# EAGLE design shiftregisters (EAGLE 6.2)
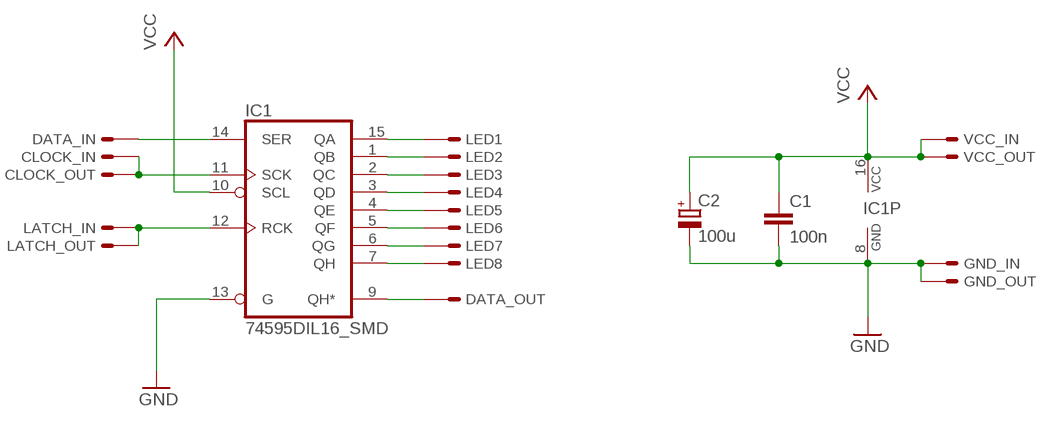
[diagram p0: schematic, sheet 1]

## Parts
C1  100n  C-EUC0805K  [C0805K]
C2  100u  CPOL-EUE2.5-5-L-12-SMD  [E2,5-5-L-12SMD]
CLOCK_IN  PINS-1-1SMD  [SMD]
CLOCK_OUT  PINS-1-1SMD  [SMD]
DATA_IN  PINS-1-1SMD  [SMD]
DATA_OUT  PINS-1-1SMD  [SMD]
GND_IN  PINS-1-1SMD  [SMD]
GND_OUT  PINS-1-1SMD  [SMD]
IC1  74595DIL16_SMD  [DIL16_SMD]
LATCH_IN  PINS-1-1SMD  [SMD]
LATCH_OUT  PINS-1-1SMD  [SMD]
LED1  PINS-1-1SMD  [SMD]
LED2  PINS-1-1SMD  [SMD]
LED3  PINS-1-1SMD  [SMD]
LED4  PINS-1-1SMD  [SMD]
LED5  PINS-1-1SMD  [SMD]
LED6  PINS-1-1SMD  [SMD]
LED7  PINS-1-1SMD  [SMD]
LED8  PINS-1-1SMD  [SMD]
VCC_IN  PINS-1-1SMD  [SMD]
VCC_OUT  PINS-1-1SMD  [SMD]

## Nets
GND: C1.2 C2.- GND_IN.1(S) GND_OUT.1(S) IC1.8(GND) IC1.13(G)
N$1: IC1.15(QA) LED1.1(S)
N$2: IC1.1(QB) LED2.1(S)
N$3: IC1.2(QC) LED3.1(S)
N$4: IC1.3(QD) LED4.1(S)
N$5: IC1.4(QE) LED5.1(S)
N$6: IC1.5(QF) LED6.1(S)
N$7: IC1.6(QG) LED7.1(S)
N$8: IC1.7(QH) LED8.1(S)
N$11: DATA_IN.1(S) IC1.14(SER)
N$12: DATA_OUT.1(S) IC1.9(QH*)
N$13: CLOCK_IN.1(S) CLOCK_OUT.1(S) IC1.11(SCK)
N$14: IC1.12(RCK) LATCH_IN.1(S) LATCH_OUT.1(S)
VCC: C1.1 C2.+ IC1.10(SCL) IC1.16(VCC) VCC_IN.1(S) VCC_OUT.1(S)

## Library data of the parts
C1 = rcl:C-EU: CAPACITOR, European symbol
C2 = elkos:CPOL-EU: POLARIZED CAPACITOR, European symbol
CLOCK_IN CLOCK_OUT DATA_IN DATA_OUT GND_IN GND_OUT LATCH_IN LATCH_OUT LED1-LED8 VCC_IN VCC_OUT = pads:PINS-1-1
IC1 = 74xx:74*595: 8-bit SHIFT REGISTER, output latch

## Board
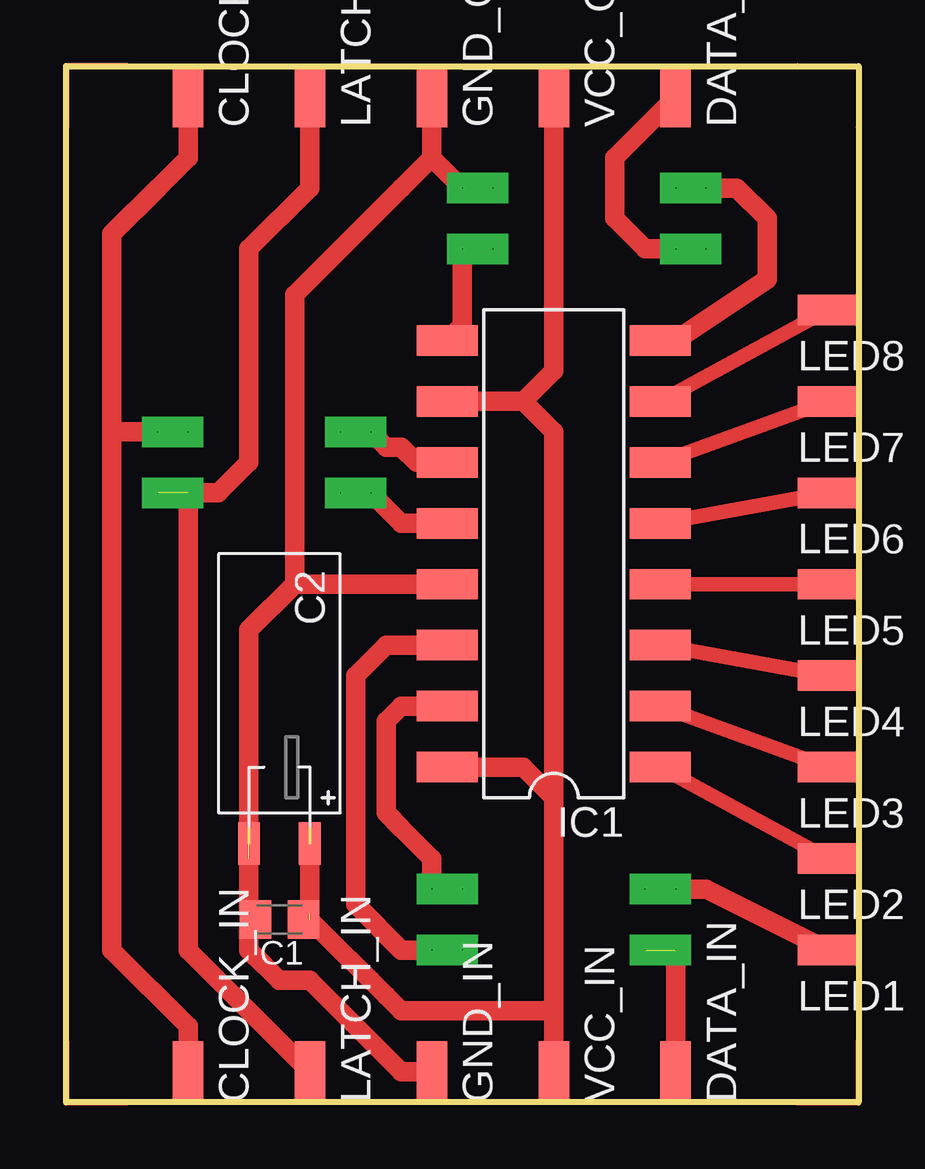
[diagram p1: board, top side]
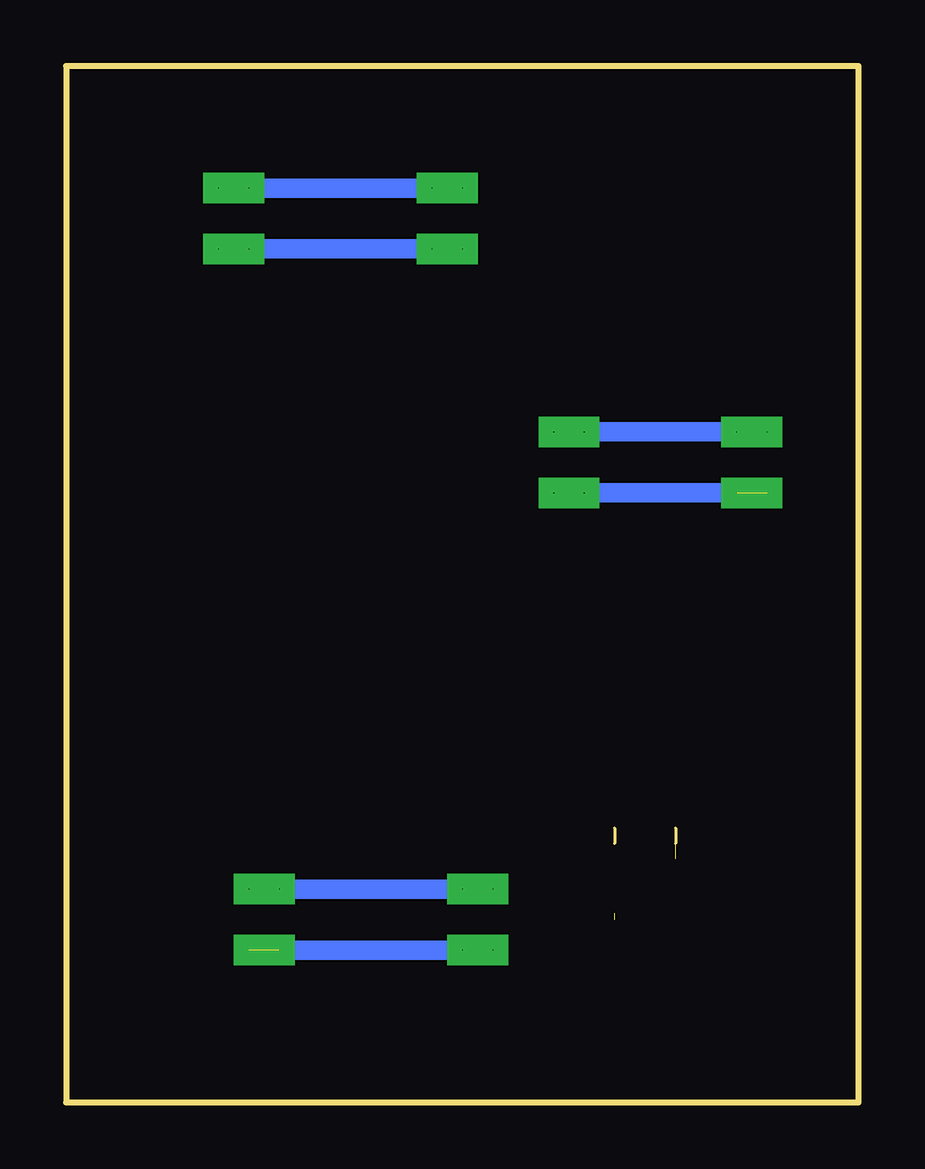
[diagram p2: board, bottom side, seen from below]

Size 33.02 x 43.18 mm. Coordinates in mm from the lower left corner, seen from the top.
Outline: 0,43.18 33.02,43.18 33.02,0 0,0 0,43.18
Copper layers (1*16): Top 0.035mm / dielectric 1.5mm / Bottom 0.035mm
Design rules "default *": minimum track width 10mil, minimum drill 24mil, track to track 8mil, track to pad 8mil, pad to pad 8mil, via to via 8mil, smd to smd 8mil, copper to edge 40mil, drill to drill 8mil, minimum pad ring 10mil, minimum via ring 8mil, stop-mask expansion 4mil, vias tented up to drill 0mil, thermal gap 10mil

### Footprints (pad centres in the part's own frame; a part is rotated, then mirrored left to right if it is on the bottom)
C0805K = smd 1.3 x 1.6: 1 -1,0; 2 1,0
E2,5-5-L-12SMD = smd 0.914 x 1.778: + -1.27,0.635; - 1.27,0.635
SMD = smd 2.54 x 1.27: 1 0,0
DIL16_SMD = smd 1.27 x 2.54: 1 -8.89,-4.445; 2 -6.35,-4.445; 3 -3.81,-4.445; 4 -1.27,-4.445; 5 1.27,-4.445; 6 3.81,-4.445; 7 6.35,-4.445; 8 8.89,-4.445; 9 8.89,4.445; 10 6.35,4.445; 11 3.81,4.445; 12 1.27,4.445; 13 -1.27,4.445; 14 -3.81,4.445; 15 -6.35,4.445; 16 -8.89,4.445

### Placement (x,y rotation side)
C1  8.89,7.62 180 top
C2  8.89,11.43 180 top
CLOCK_IN  5.08,1.27 90 top
CLOCK_OUT  5.08,41.91 90 top
DATA_IN  25.4,1.27 90 top
DATA_OUT  25.4,41.91 90 top
GND_IN  15.24,1.27 90 top
GND_OUT  15.24,41.91 90 top
IC1  20.32,22.86 90 top
LATCH_IN  10.16,1.27 90 top
LATCH_OUT  10.16,41.91 90 top
LED1  31.75,6.35 0 top
LED2  31.75,10.16 0 top
LED3  31.75,13.97 0 top
LED4  31.75,17.78 0 top
LED5  31.75,21.59 0 top
LED6  31.75,25.4 0 top
LED7  31.75,29.21 0 top
LED8  31.75,33.02 0 top
VCC_IN  20.32,1.27 90 top
VCC_OUT  20.32,41.91 90 top

### Tracks (layer width: path | path; a pad name or v marks a point on that pad's centre or on a via)
GND  (via drill 0.03 pad 1.27)  (1 unrouted)
  Top 0.813: IC1.13 12.7,21.59 9.53,21.59 | GND_OUT.1 15.24,40.64 | IC1.8 25.4,31.75 29.21,34.29 29.21,36.83 27.94,38.1 v26.67,38.1 v25.4,38.1 | v17.78,38.1 v16.51,38.1 15.24,39.37 | 15.24,39.37 15.24,40.64 | 15.24,40.64 15.24,39.37 | 15.24,39.37 13.97,38.1 9.53,33.66 9.53,32.39 9.53,21.59 | 9.53,21.59 7.62,19.68 C2.- | 7.62,10.16 7.62,7.89 C1.2 7.62,7.35 7.62,6.35 8.26,5.71 8.89,5.08 10.16,5.08 13.97,1.27 GND_IN.1
  Bottom 0.813: v17.78,38.1 v25.4,38.1
N$1  (via drill 0.03 pad 1.27)
  Top 0.813: v16.51,8.89 v15.24,8.89 15.24,10.16 13.97,11.43 13.33,12.07 13.33,15.88 13.97,16.51 15.24,16.51 IC1.15 | LED1.1 26.67,8.89 v25.4,8.89 v24.13,8.89
  Bottom 0.813: v16.51,8.89 v24.13,8.89
N$2
  Top 0.61: IC1.1 LED2.1
N$3
  Top 0.61: IC1.2 LED3.1
N$4
  Top 0.61: IC1.3 LED4.1
N$5
  Top 0.61: IC1.4 LED5.1
N$6
  Top 0.61: IC1.5 LED6.1
N$7
  Top 0.61: IC1.6 LED7.1
N$8
  Top 0.61: IC1.7 LED8.1
N$9
  Top 0.254: 0,2.54 0,0 2.54,0
N$10
  Top 0.254: 30.48,0 33.02,0 33.02,2.54
N$11  (via drill 0.03 pad 1.27)  (1 unrouted)
  Top 0.813: v16.51,6.35 v15.24,6.35 13.97,6.35 12.06,8.25 12.06,17.78 13.33,19.05 IC1.14 | DATA_IN.1 v25.4,6.35
  Bottom 0.813: v16.51,6.35 v24.13,6.35
N$12  (via drill 0.03 pad 1.27)
  Top 0.813: IC1.9 16.51,32.39 16.51,34.29 v16.51,35.56 v17.78,35.56 | v26.67,35.56 v25.4,35.56 24.13,35.56 22.86,36.83 22.86,39.37 DATA_OUT.1
  Bottom 0.813: v17.78,35.56 v25.4,35.56
N$13  (via drill 0.03 pad 1.27)
  Top 0.813: CLOCK_OUT.1 5.08,39.37 3.81,38.1 1.91,36.19 1.91,27.94 | v11.43,27.94 v12.7,27.94 13.33,27.31 13.97,27.31 14.6,26.67 IC1.11 | v5.08,27.94 v3.81,27.94 1.91,27.94 | CLOCK_IN.1 5.08,3.18 1.91,6.35 1.91,27.94
  Bottom 0.813: v5.08,27.94 v11.43,27.94
N$14  (via drill 0.03 pad 1.27)  (1 unrouted)
  Top 0.813: LATCH_OUT.1 10.16,39.37 10.16,38.1 7.62,35.56 7.62,26.67 6.35,25.4 v5.08,25.4 5.08,6.35 LATCH_IN.1 | v11.43,25.4 v12.7,25.4 13.97,24.13 IC1.12
  Bottom 0.813: v5.08,25.4 v11.43,25.4
  other vias: 3.81,25.4
N$15
  Top 0.254: 30.48,43.18 33.02,43.18 33.02,40.64
N$16
  Top 0.254: 2.54,43.18 0,43.18 0,40.64
VCC  (2 unrouted)
  Top 0.813: IC1.16 15.24,13.97 19.05,13.97 20.32,12.7 | VCC_IN.1 20.32,3.81 | 20.32,3.81 15.24,3.81 13.97,3.81 13.33,4.45 | 13.33,4.45 12.7,5.08 | VCC_OUT.1 20.32,30.48 19.05,29.21 | 19.05,29.21 IC1.10 19.05,29.21 | 20.32,12.7 20.32,3.81 | 19.05,29.21 20.32,27.94 20.32,12.7 | 10.16,11.16 10.16,7.89 C1.1 | 10.16,7.62 13.33,4.45